# Altium schematic sheet 1-Regulator.SchDoc
size A4; Author: Fabian Castaño; CompanyName: GIBIC Tech-Hub; Engineer: Fabian Castaño; Organization: Universidad de Antioquia; Address1: UdeA; Address2: Medellín; Address3: Antioquia; Address4: Colombia 050010; DocumentNumber: 2; SheetNumber: 2; SheetTotal: 4
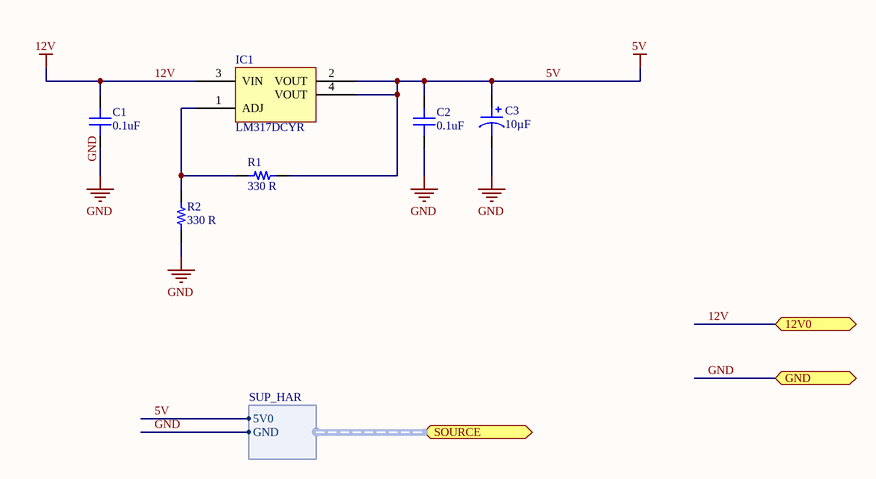
[diagram p0: 1-Regulator.SchDoc]

## Parts
C1  0.1uF  [CAP 0805_2012]
C2  0.1uF  [CAP 0805_2012]
C3  10µF  [CAP POL 1206_3216]
IC1  LM317DCYR  [TI SOT-223 DCY]
R1  330 R  [RES 0805_2012]
R2  330 R  [RES 0805_2012]

## Ports
12V0, GND, SOURCE (harness SUP_HAR)

## Harnesses
SUP_HAR: 5V0, GND

## Nets
5V: C2.2 C3.1 IC1.2(VOUT) IC1.4(VOUT) R1.2 ; port SOURCE.5V0
12V: C1.2 IC1.3(VIN) ; port 12V0
GND: C1.1 C2.1 C3.2 R2.1 ; port GND, port SOURCE.GND
NetIC1_1: IC1.1(ADJ) R1.1 R2.2

## Notes on the sheet
- Notes
- Title
- Size:
- Date:
- A4
- Number:
- Time:
- Revision:
- Sheet
- of
- File:

## Library data of the parts
C1 C2 = CBR08C569BCGAC: CAP CER 5.6PF 500V C0G/NP0 0805; Manufacturer: KEMET; Temperature Coefficient: C0G, NP0; Tolerance: ±0.1pF; Part Number: CBR08C569BCGAC; Value: 0.1uF; Applications: RF, Microwave, High Frequency; Capacitance: 5.6pF; ComponentLink1Description: Datasheet; ComponentLink1URL: https://api.kemet.com/component-edge/download/datasheet/CBR08C569BCGAC.pdf; ComponentLink2Description: DigiKey Link; ComponentLink2URL: http://digikey.com/product-detail/en/kemet/CBR08C569BCGAC/399-11260-1-ND/4376887; Device Package: 0805 (2012 Metric); Features: High Q, Low Loss, Ultra Low ESR; LastUpdated: 2/09/2020 01:04:42; Lifecycle Status: Active; Minimum Order: 1; Mounting Type: Surface Mount, MLCC; Operating Temperature: -55°C ~ 125°C; Package / Case: 0805 (2012 Metric); Packaging: TapeAndReel; PartId: 2427; Part Status: Active; Price: 0.48; Series: CBR-SMD RF C0G; Size / Dimension: 0.079" L x 0.049" W (2.00mm x 1.25mm); Supplier 1: DigiKey; Supplier Part Number 1: 399-11260-1-ND; Thickness (Max): 0.037" (0.95mm); Voltage - Rated: 500V
C3 = TR3A336K6R3C0600: CAP TANT 33UF 10% 6.3V 1206; Manufacturer: Vishay Sprague; Manufacturer Size Code: A; Capacitance: 33µF; ESR (Equivalent Series Resistance): 600mOhm; Type: Molded; Part Number: TR3A336K6R3C0600; Value: 10µF; ComponentLink1Description: Datasheet; ComponentLink1URL: http://www.vishay.com/docs/40080/tr3.pdf; ComponentLink2Description: DigiKey Link; ComponentLink2URL: http://digikey.com/product-detail/en/vishay-sprague/TR3A336K6R3C0600/718-1305-1-ND/1663027; Device Package: 1206 (3216 Metric); Features: General Purpose; Height - Seated (Max): 0.071" (1.80mm); LastUpdated: 2/09/2020 01:15:58; Lifecycle Status: Active; Minimum Order: 1; Mounting Type: Surface Mount; Operating Temperature: -55°C ~ 125°C; Package / Case: 1206 (3216 Metric); Packaging: TapeAndReel; PartId: 297; Part Status: Active; Price: 0.24; Series: TANTAMOUNT®, TR3; Size / Dimension: 0.126" L x 0.063" W (3.20mm x 1.60mm); Supplier 1: DigiKey; Supplier Part Number 1: 718-1305-1-ND; Tolerance: ±10%; Voltage - Rated: 6.3V
IC1 = LM317DCYR: IC REG LIN POS ADJ 1.5A SOT223-4; Manufacturer: Texas Instruments; Number of Regulators: 1; Output Configuration: Positive; Output Type: Adjustable; Protection Features: Over Temperature, Short Circuit; PSRR: 64dB ~ 57dB (120Hz); Voltage - Input (Max): 40V; Voltage - Output (Max): 37V; Voltage - Output (Min/Fixed): 1.25V; Part Number: LM317DCYR; ComponentLink1Description: Datasheet; ComponentLink1URL: http://www.ti.com/general/docs/suppproductinfo.tsp?distId=10&gotoUrl=http%3A%2F%2Fwww.ti.com%2Flit%2Fgpn%2Flm317; ComponentLink2Description: DigiKey Link; ComponentLink2URL: //digikey.com/product-detail/en/texas-instruments/LM317DCYR/296-12602-2-ND/443739; Current - Output: 1.5A; Device Package: TO-261-4, TO-261AA; LastUpdated: 9/12/2019 14:53:08; Lifecycle Status: 0; Minimum Order: 1; Mounting Type: Surface Mount; Operating Temperature: 0°C ~ 125°C; Package / Case: TO-261-4, TO-261AA; Packaging: TapeAndReel; Part Status: Active; Price: 0.28; Series: -; Supplier 1: DigiKey; Supplier Part Number 1: 296-12602-2-ND; Supplier Device Package: SOT-223-4
R1 R2 = RNCF0805DTE82K0: RES 82K OHM 0.5% 1/8W 0805; Manufacturer: Stackpole Electronics Inc; Power (Watts): 0.125W, 1/8W; Resistance: 82 kOhms; Temperature Coefficient: ±25ppm/°C; Part Number: RNCF0805DTE82K0; Value: 330 R; ComponentLink1Description: Datasheet; ComponentLink1URL: https://www.seielect.com/catalog/sei-rncf.pdf; ComponentLink2Description: DigiKey Link; ComponentLink2URL: http://digikey.com/product-detail/en/stackpole-electronics-inc/RNCF0805DTE82K0/RNCF0805DTE82K0CT-ND/9915472; Composition: Thin Film; Device Package: 0805 (2012 Metric); Features: Automotive AEC-Q200; Height - Seated (Max): 0.026" (0.65mm); LastUpdated: 2/09/2020 01:15:08; Lifecycle Status: Active; Minimum Order: 1; Number of Terminations: 2; Operating Temperature: -55°C ~ 155°C; Package / Case: 0805 (2012 Metric); Packaging: TapeAndReel; PartId: 35165; Part Status: Active; Price: 0.02; Ratings: AEC-Q200; Series: RNCF; Size / Dimension: 0.079" L x 0.049" W (2.00mm x 1.25mm); Supplier 1: DigiKey; Supplier Part Number 1: RNCF0805DTE82K0CT-ND; Supplier Device Package: 0805; Tolerance: ±0.5%